# EAGLE design desk-trick-board (EAGLE 9.5.2)
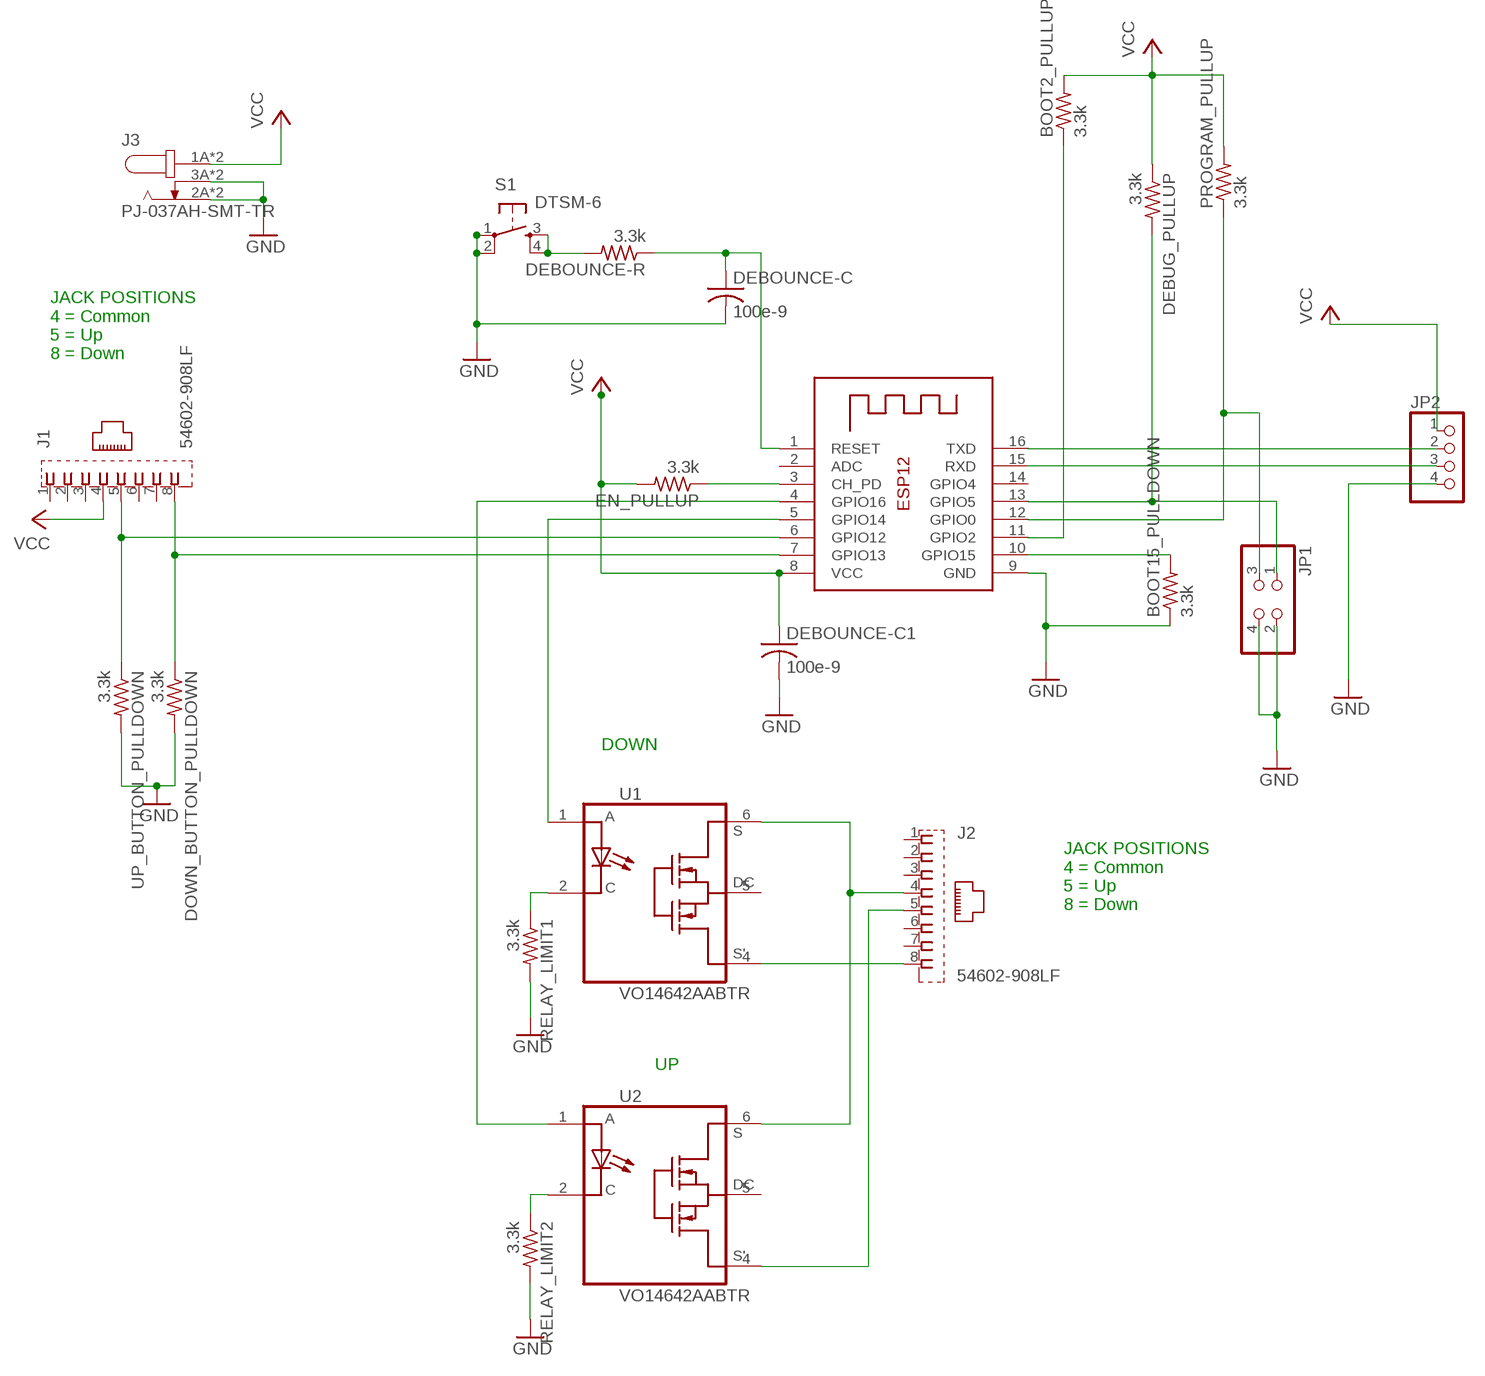
[diagram p0: schematic, sheet 1]

## Parts
BOOT2_PULLUP  3.3k  R-US_R0603  [R0603]
BOOT15_PULLDOWN  3.3k  R-US_R0603  [R0603]
DEBOUNCE-C  100e-9  C-USC0603  [C0603]
DEBOUNCE-C1  100e-9  C-USC0603  [C0603]
DEBOUNCE-R  3.3k  R-US_R0603  [R0603]
DEBUG_PULLUP  3.3k  R-US_R0603  [R0603]
DOWN_BUTTON_PULLDOWN  3.3k  R-US_R0603  [R0603]
EN_PULLUP  3.3k  R-US_R0603  [R0603]
J1  54602-908LF  [AMPHENOL_54602-908LF]
J2  54602-908LF  [AMPHENOL_54602-908LF]
J3  PJ-037AH-SMT-TR  [CUI_PJ-037AH-SMT-TR]
JP1  PINHD-2X2  [2X02]
JP2  PINHD-1X4  [1X04]
PROGRAM_PULLUP  3.3k  R-US_R0603  [R0603]
RELAY_LIMIT1  3.3k  R-US_R0603  [R0603]
RELAY_LIMIT2  3.3k  R-US_R0603  [R0603]
S1  DTSM-6  [DTSM-6]
U1  VO14642AABTR  [SOIC254P1005X390-6N]
U2  VO14642AABTR  [SOIC254P1005X390-6N]
UP_BUTTON_PULLDOWN  3.3k  R-US_R0603  [R0603]
X1  ESP-12  [ESP-12]

## Nets
BOOT2: BOOT2_PULLUP.1 X1.11(GPIO2)
BOOT15: BOOT15_PULLDOWN.2 X1.10(GPIO15)
DEBUG: DEBUG_PULLUP.2 JP1.1 X1.13(GPIO5)
ESP_EN: EN_PULLUP.1 X1.3(CH_PD)
ESPRX: JP2.3 X1.15(RXD)
ESPTX: JP2.2 X1.16(TXD)
GND: BOOT15_PULLDOWN.1 DEBOUNCE-C1.2 DEBOUNCE-C.2 DOWN_BUTTON_PULLDOWN.2 J3.2A J3.2B J3.3A J3.3B JP1.2 JP1.4 JP2.4 RELAY_LIMIT1.2 RELAY_LIMIT2.2 S1.1 S1.2 UP_BUTTON_PULLDOWN.2 X1.9(GND)
IN_BD: DOWN_BUTTON_PULLDOWN.1 J1.8 X1.7(GPIO13)
IN_BU: J1.5 UP_BUTTON_PULLDOWN.1 X1.6(GPIO12)
N$7: RELAY_LIMIT2.1 U2.2(C)
N$8: RELAY_LIMIT1.1 U1.2(C)
N$9: U1.1(A) X1.5(GPIO14)
N$10: U2.1(A) X1.4(GPIO16)
OUT_BD: J2.8 U1.4(S')
OUT_BU: J2.5 U2.4(S')
OUT_COMMON: J2.4 U1.6(S) U2.6(S)
PROGRAM: JP1.3 PROGRAM_PULLUP.1 X1.12(GPIO0)
RST: DEBOUNCE-C.1 DEBOUNCE-R.1 X1.1(RESET)
RSTPRESS: DEBOUNCE-R.2 S1.3 S1.4
VCC: BOOT2_PULLUP.2 DEBOUNCE-C1.1 DEBUG_PULLUP.1 EN_PULLUP.2 J1.4 J3.1A J3.1B JP2.1 PROGRAM_PULLUP.2 X1.8(VCC)
Unconnected: J1.1 J1.2 J1.3 J1.6 J1.7 J2.1 J2.2 J2.3 J2.6 J2.7 U1.5(DC) U2.5(DC) X1.2(ADC) X1.14(GPIO4)

## Notes on the sheet
- JACK POSITIONS
  4 = Common
  5 = Up
  8 = Down
- DOWN
- JACK POSITIONS
  4 = Common
  5 = Up
  8 = Down
- UP

## Library data of the parts
BOOT2_PULLUP BOOT15_PULLDOWN DEBOUNCE-R DEBUG_PULLUP DOWN_BUTTON_PULLDOWN EN_PULLUP PROGRAM_PULLUP RELAY_LIMIT1 RELAY_LIMIT2 UP_BUTTON_PULLDOWN = rcl:R-US_: RESISTOR, American symbol
DEBOUNCE-C DEBOUNCE-C1 = rcl:C-US: CAPACITOR, American symbol
J1 J2 = 54602-908LF:54602-908LF: CONN MOD JACK 8P8C R/A UNSHLD; DESCRIPTION: Jack Modular Connector 8p8c _RJ45, Ethernet_ 90° Angle _Right_ Unshielded Cat3; DIGI-KEY_PART_NUMBER: 609-1046-ND; DIGI-KEY_PURCHASE_URL: https://www.digikey.com/product-detail/en/amphenol-icc-fci/54602-908LF/609-1046-ND/1001360?utm_source=snapeda&utm_medium=aggregator&utm_campaign=symbol; MF: Amphenol ICC; MP: 54602-908LF; PACKAGE: None
J3 = PJ-037AH-SMT-TR:PJ-037AH-SMT-TR: 2.0 mm Center Pin, 5.0 A, Right Angle, Surface Mount (SMT), Dc Power Jack Connector; AVAILABILITY: Unavailable; CUI_PURCHASE_URL: https://www.cuidevices.com/product/interconnect/connectors/dc-power-connectors/jacks/pj-037ah-smt-tr?utm_source=snapeda.com&utm_medium=referral&utm_campaign=snapedaBOM; DESCRIPTION: 2.0 x 6.3 mm, 5.0 A, Horizontal, Surface Mount _SMT_, Dc Power Jack Connector; MF: CUI Devices; MP: PJ-037AH-SMT-TR; PACKAGE: None; PRICE: None
JP1 = pinhead:PINHD-2X2: PIN HEADER
JP2 = pinhead@1:PINHD-1X4: PIN HEADER
S1 = switch-tact:DTSM-6
U1 U2 = VO14642AABTR:VO14642AABTR; DESCRIPTION: Solid State SPST-NO _1 Form A_ 6-SMD _0.300, 7.62mm_; DIGI-KEY_PART_NUMBER: VO14642AABCT-ND; DIGI-KEY_PURCHASE_URL: https://www.digikey.com/product-detail/en/vishay-semiconductor-opto-division/VO14642AABTR/VO14642AABCT-ND/4743823?utm_source=snapeda&utm_medium=aggregator&utm_campaign=symbol; MF: Vishay; MP: VO14642AABTR; PACKAGE: SMD-6 Vishay
X1 = adafruit:ESP-12

## Board
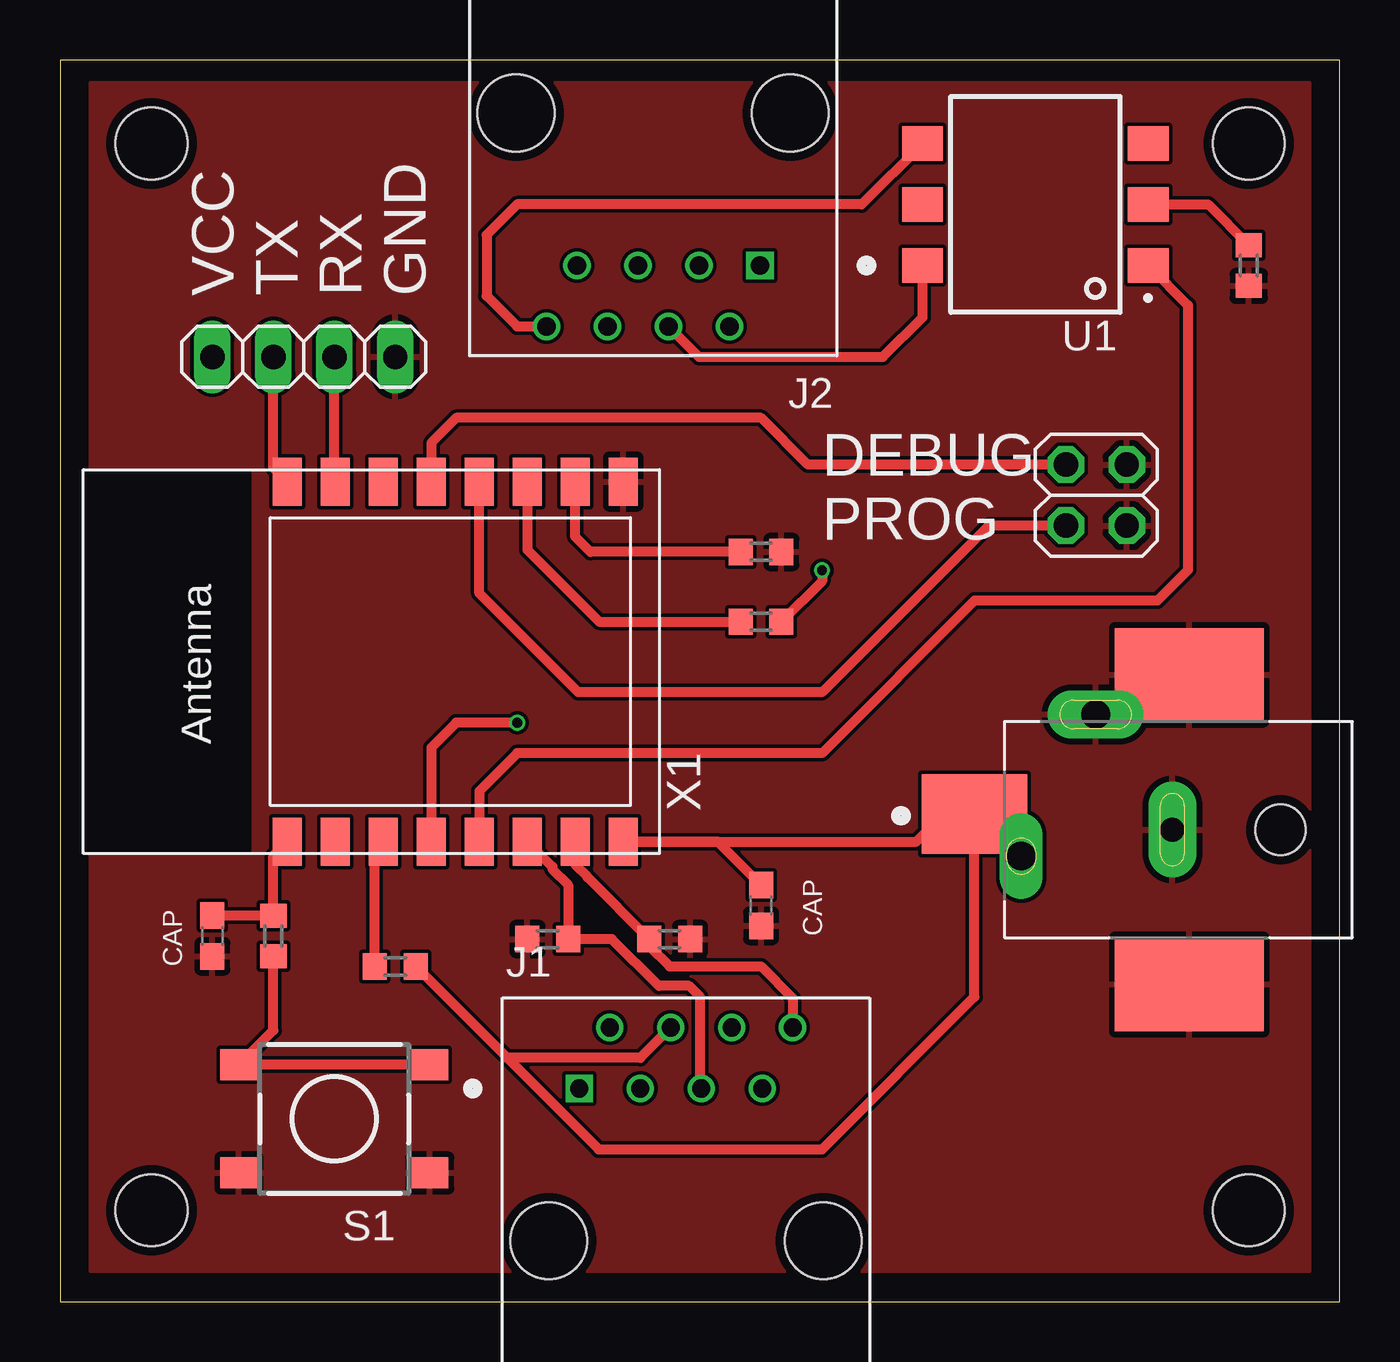
[diagram p1: board, top side]
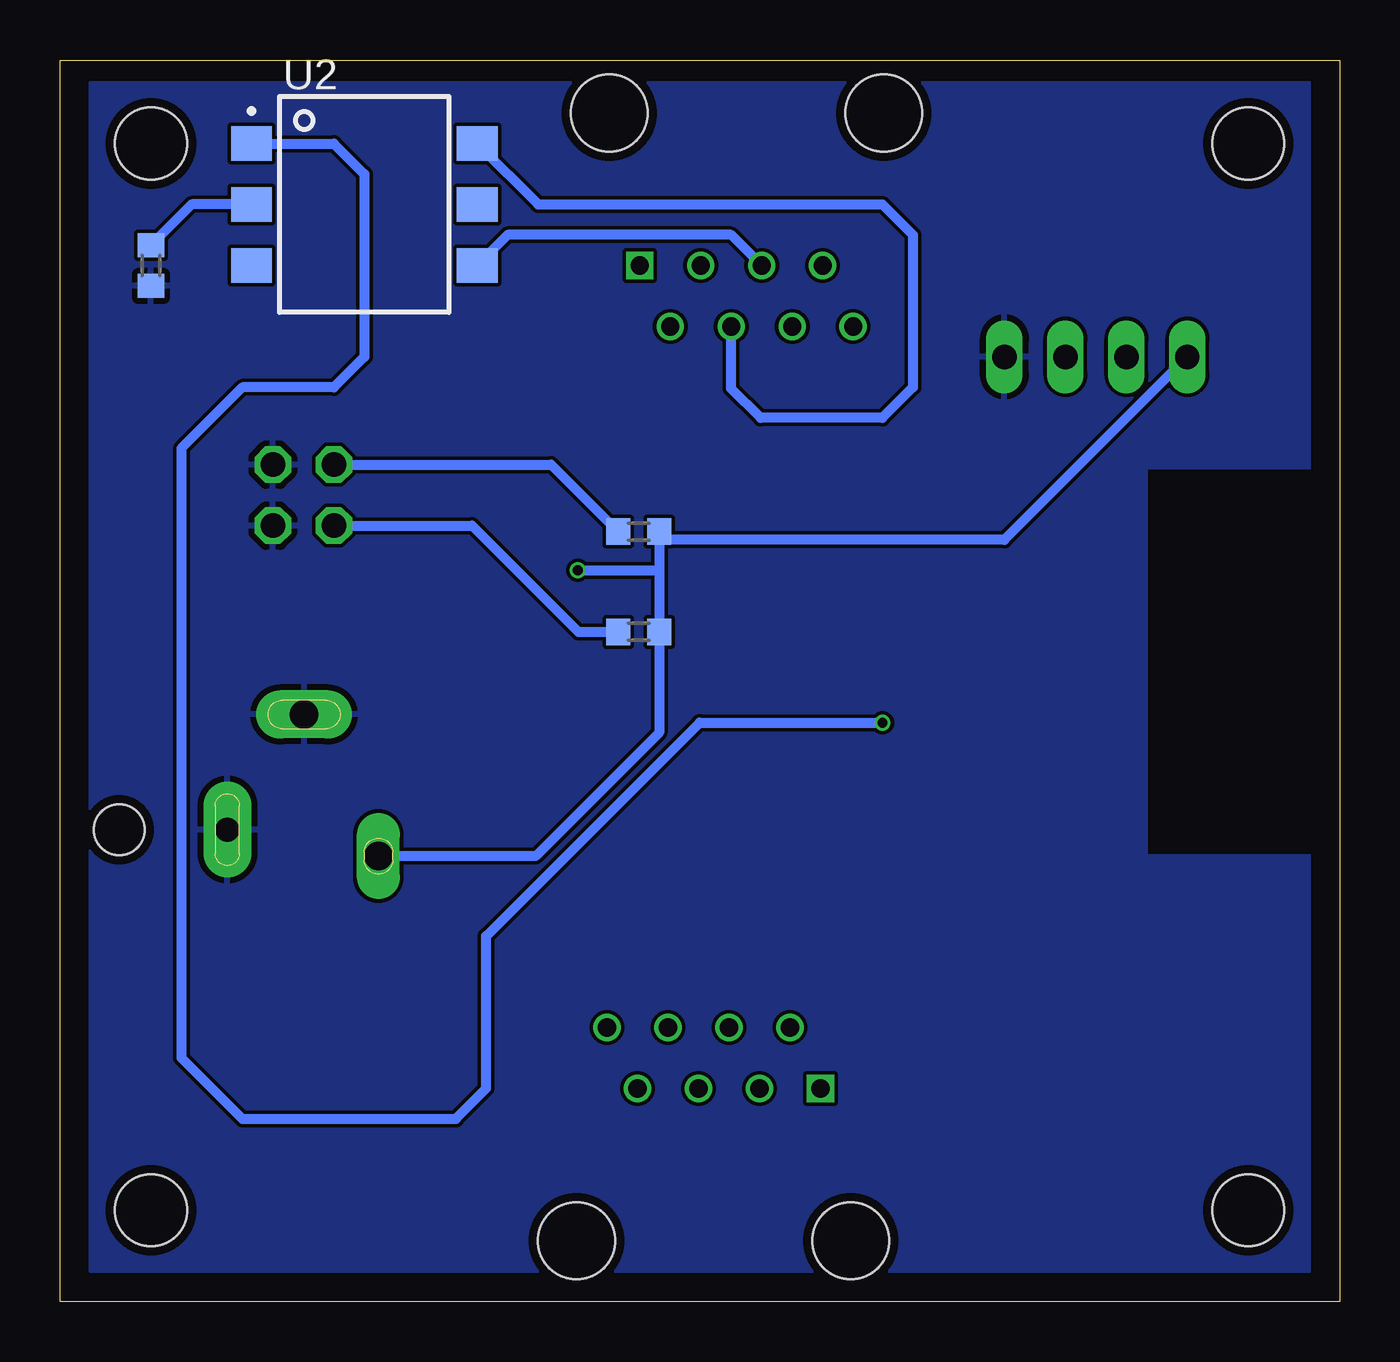
[diagram p2: board, bottom side, seen from below]

Size 53.32 x 51.74 mm. Coordinates in mm from the lower left corner, seen from the top.
Outline: 0,0 53.32,0 53.32,51.74 0,51.74 0,0
Copper layers (1*16): Top 0.035559375mm / dielectric 1.6mm / Bottom 0.035559375mm
Design rules "oshpark-2layer": minimum track width 6mil, minimum drill 10mil, track to track 6mil, track to pad 6mil, pad to pad 6mil, via to via 6mil, smd to smd 6mil, copper to edge 15mil, drill to drill 6mil, minimum pad ring 5mil, minimum via ring 5mil, stop-mask expansion 2.5mil, vias tented up to drill 0mil, thermal gap 10mil
Holes 3 mm at 49.53,48.26 49.53,3.81 3.81,3.81 3.81,48.26

### Footprints (pad centres in the part's own frame; a part is rotated, then mirrored left to right if it is on the bottom)
R0603 = smd 1 x 1.1: 1 -0.85,0; 2 0.85,0
C0603 = smd 1.1 x 1: 1 -0.85,0; 2 0.85,0
AMPHENOL_54602-908LF = drill 0.76 square: 1 -4.445,6.35 | drill 0.76: 2 -3.175,8.89; 3 -1.905,6.35; 4 -0.635,8.89; 5 0.635,6.35; 6 1.905,8.89; 7 3.175,6.35; 8 4.445,8.89 | hole 3.2: -5.715,0; 5.715,0
CUI_PJ-037AH-SMT-TR = smd 4.4 x 3.3: 1A 0,0 | drill 1.2 long: 1B -1.95,1.75 | smd 6.2 x 3.9: 2A -8.95,7.1; 3A -8.95,-5.8 | drill 1 pad 2 long: 2B -8.25,0.65 | drill 1.2 pad 2 long: 3B -5.05,-4.15 | hole 2.1: -12.75,0.65
2X02 = drill 1.016 octagon: 1 -1.27,-1.27; 2 -1.27,1.27; 3 1.27,-1.27; 4 1.27,1.27
1X04 = drill 1.016 long: 1 -3.81,0; 2 -1.27,0; 3 1.27,0; 4 3.81,0
DTSM-6 = smd 1.55 x 1.3: 1 -3.975,2.25; 2 3.975,2.25; 3 -3.975,-2.25; 4 3.975,-2.25
SOIC254P1005X390-6N = smd 1.7 x 1.45: 1 -4.7,2.54; 2 -4.7,0; 3 -4.7,-2.54; 4 4.7,-2.54; 5 4.7,0; 6 4.7,2.54
ESP-12 = smd 2 x 1.2: 1 -7.5,4.5; 2 -7.5,2.5; 3 -7.5,0.5; 4 -7.5,-1.5; 5 -7.5,-3.5; 6 -7.5,-5.5; 7 -7.5,-7.5; 8 -7.5,-9.5; 9 7.5,-9.5; 10 7.5,-7.5; 11 7.5,-5.5; 12 7.5,-3.5; 13 7.5,-1.5; 14 7.5,0.5; 15 7.5,2.5; 16 7.5,4.5

### Placement (x,y rotation side)
BOOT2_PULLUP  29.21,28.33 0 top
BOOT15_PULLDOWN  29.21,31.24 180 top
DEBOUNCE-C  6.35,15.24 270 top
DEBOUNCE-C1  29.21,16.51 270 top
DEBOUNCE-R  8.89,15.24 270 top
DEBUG_PULLUP  29.21,32.09 180 bottom
DOWN_BUTTON_PULLDOWN  25.4,15.11 0 top
EN_PULLUP  13.97,13.97 0 top
J1  26.08,2.54 0 top
J2  24.72,49.53 180 top
J3  38.1,20.32 180 top
JP1  43.18,33.61 270 top
JP2  10.16,39.37 0 top
PROGRAM_PULLUP  29.21,27.91 0 bottom
RELAY_LIMIT1  49.53,43.18 270 top
RELAY_LIMIT2  49.53,43.18 270 bottom
S1  11.43,7.62 180 top
U1  40.64,45.72 180 top
U2  40.64,45.72 0 bottom
UP_BUTTON_PULLDOWN  20.32,15.11 180 top
X1  13.97,26.67 90 top

### Tracks (layer width: path | path; a pad name or v marks a point on that pad's centre or on a via)
BOOT2
  Top 0.406: X1.11 19.47,31.33 22.46,28.34 BOOT2_PULLUP.1
BOOT15
  Top 0.406: BOOT15_PULLDOWN.2 22.1,31.24 21.47,31.87 X1.10
DEBUG
  Top 0.406: JP1.1 31.16,34.88 29.21,36.83 16.51,36.83 15.47,35.79 X1.13
  Bottom 0.406: JP1.1 32.85,34.88 DEBUG_PULLUP.2
ESP_EN
  Top 0.406: EN_PULLUP.1 13.12,18.82 X1.3
ESPRX
  Top 0.406: X1.15 11.43,34.21 JP2.3
ESPTX
  Top 0.406: X1.16 8.89,34.75 JP2.2
GND
  pour Top (isolate 0): 1.27,50.8 52.07,50.8 52.07,1.27 1.27,1.27
  pour Top (isolate 0): 1.27,50.8 52.07,50.8 52.07,1.27 1.27,1.27
  pour Bottom: 52.07,50.8 52.07,1.27 1.27,1.27 1.27,50.8
IN_BD
  Top 0.406: X1.7 21.47,18.22 21.98,17.7 21.98,17.68 DOWN_BUTTON_PULLDOWN.1 24.55,14.82 25.4,13.97 29.21,13.97 30.53,12.65 J1.8
IN_BU
  Top 0.406: X1.6 20.51,18.13 20.51,18.02 21.17,17.37 UP_BUTTON_PULLDOWN.1 23,15.11 24.95,13.16 26.21,13.16 26.67,12.7 26.67,8.94 J1.5
N$7
  Bottom 0.406: U2.2 47.84,45.72 RELAY_LIMIT2.1
N$8
  Top 0.406: U1.2 47.84,45.72 RELAY_LIMIT1.1
N$9
  Top 0.406: U1.1 46.99,41.53 46.99,30.48 45.72,29.21 38.1,29.21 31.75,22.86 19.05,22.86 17.47,21.28 X1.5
N$10  (via drill 0.41)
  Top 0.406: v19.05,24.13 16.51,24.13 15.47,23.09 X1.4
  Bottom 0.406: U2.1 41.91,48.26 40.64,46.99 40.64,39.37 41.91,38.1 45.72,38.1 48.26,35.56 48.26,10.16 45.72,7.62 36.83,7.62 35.56,8.89 35.56,15.24 26.67,24.13 v19.05,24.13
OUT_BD
  Top 0.406: U1.4 33.4,45.72 19.05,45.72 17.78,44.45 17.78,41.91 19.05,40.64 J2.8
OUT_BU
  Bottom 0.406: J2.5 25.35,44.45 34.67,44.45 U2.4
OUT_COMMON
  Top 0.406: J2.4 26.62,39.37 34.29,39.37 35.94,41.02 U1.6
  Bottom 0.406: U2.6 33.4,45.72 19.05,45.72 17.78,44.45 17.78,38.1 19.05,36.83 24.13,36.83 25.35,38.05 J2.4
PROGRAM
  Top 0.406: JP1.3 38.69,32.34 31.75,25.4 21.59,25.4 17.47,29.52 X1.12
  Bottom 0.406: JP1.3 36.15,32.34 31.72,27.91 PROGRAM_PULLUP.1
RST
  Top 0.406: DEBOUNCE-C.1 DEBOUNCE-R.1 8.89,18.59 X1.1
RSTPRESS
  Top 0.406: S1.3 S1.4 8.89,11.3 DEBOUNCE-R.2
VCC  (via drill 0.41)
  Top 0.406: J1.4 24.18,10.16 18.63,10.16 | EN_PULLUP.2 18.63,10.16 | 18.63,10.16 22.44,6.35 31.75,6.35 38.1,12.7 J3.1A | J3.1B 39.85,18.57 J3.1A | J3.1A 36.83,20.32 35.68,19.17 X1.8 27.4,19.17 DEBOUNCE-C1.1 | v31.75,30.48 31.75,30.02 BOOT2_PULLUP.2
  Bottom 0.406: DEBUG_PULLUP.1 28.36,31.75 | 28.36,31.75 28.36,30.48 | 28.36,30.48 PROGRAM_PULLUP.2 28.36,23.71 33.5,18.57 J3.1B | JP2.1 13.97,31.75 28.36,31.75 | v31.75,30.48 28.36,30.48

### Text on the board
tNames: VCC / TX / RX / GND | DEBUG / PROG | CAP | CAP